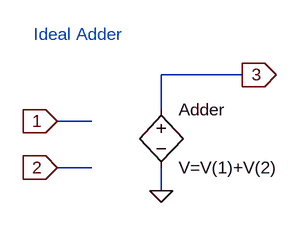
[diagram p0: schematic adder.asc]
adder.asc, the LTspice schematic file:
Version 4
SHEET 1 880 680
WIRE 288 32 176 32
WIRE 176 80 176 32
WIRE 80 96 32 96
WIRE 80 160 32 160
WIRE 176 192 176 160
FLAG 32 96 1
IOPIN 32 96 In
FLAG 32 160 2
IOPIN 32 160 In
FLAG 288 32 3
IOPIN 288 32 Out
FLAG 176 192 0
SYMBOL bv 176 64 R0
SYMATTR InstName Adder
SYMATTR Value V=V(1)+V(2)
TEXT 0 -24 Left 2 ;Ideal Adder

The netlist it stands for:
* adder.asc
B§Adder 3 0 V=V(1)+V(2)
* Ideal Adder
.backanno
.end